# EasyEDA Pro project 工创赛底盘主控v3_2025-03-24.epro, schematic Schematic1
Board Name: Board1; Create Date: 2025-03-23; Page Name: P1; Project Name: 底盘主控v3; Schematic Name: Schematic1; Update Date: 2025-03-24; Company: 嘉立创EDA; Page Size: A4; Version: V1.0
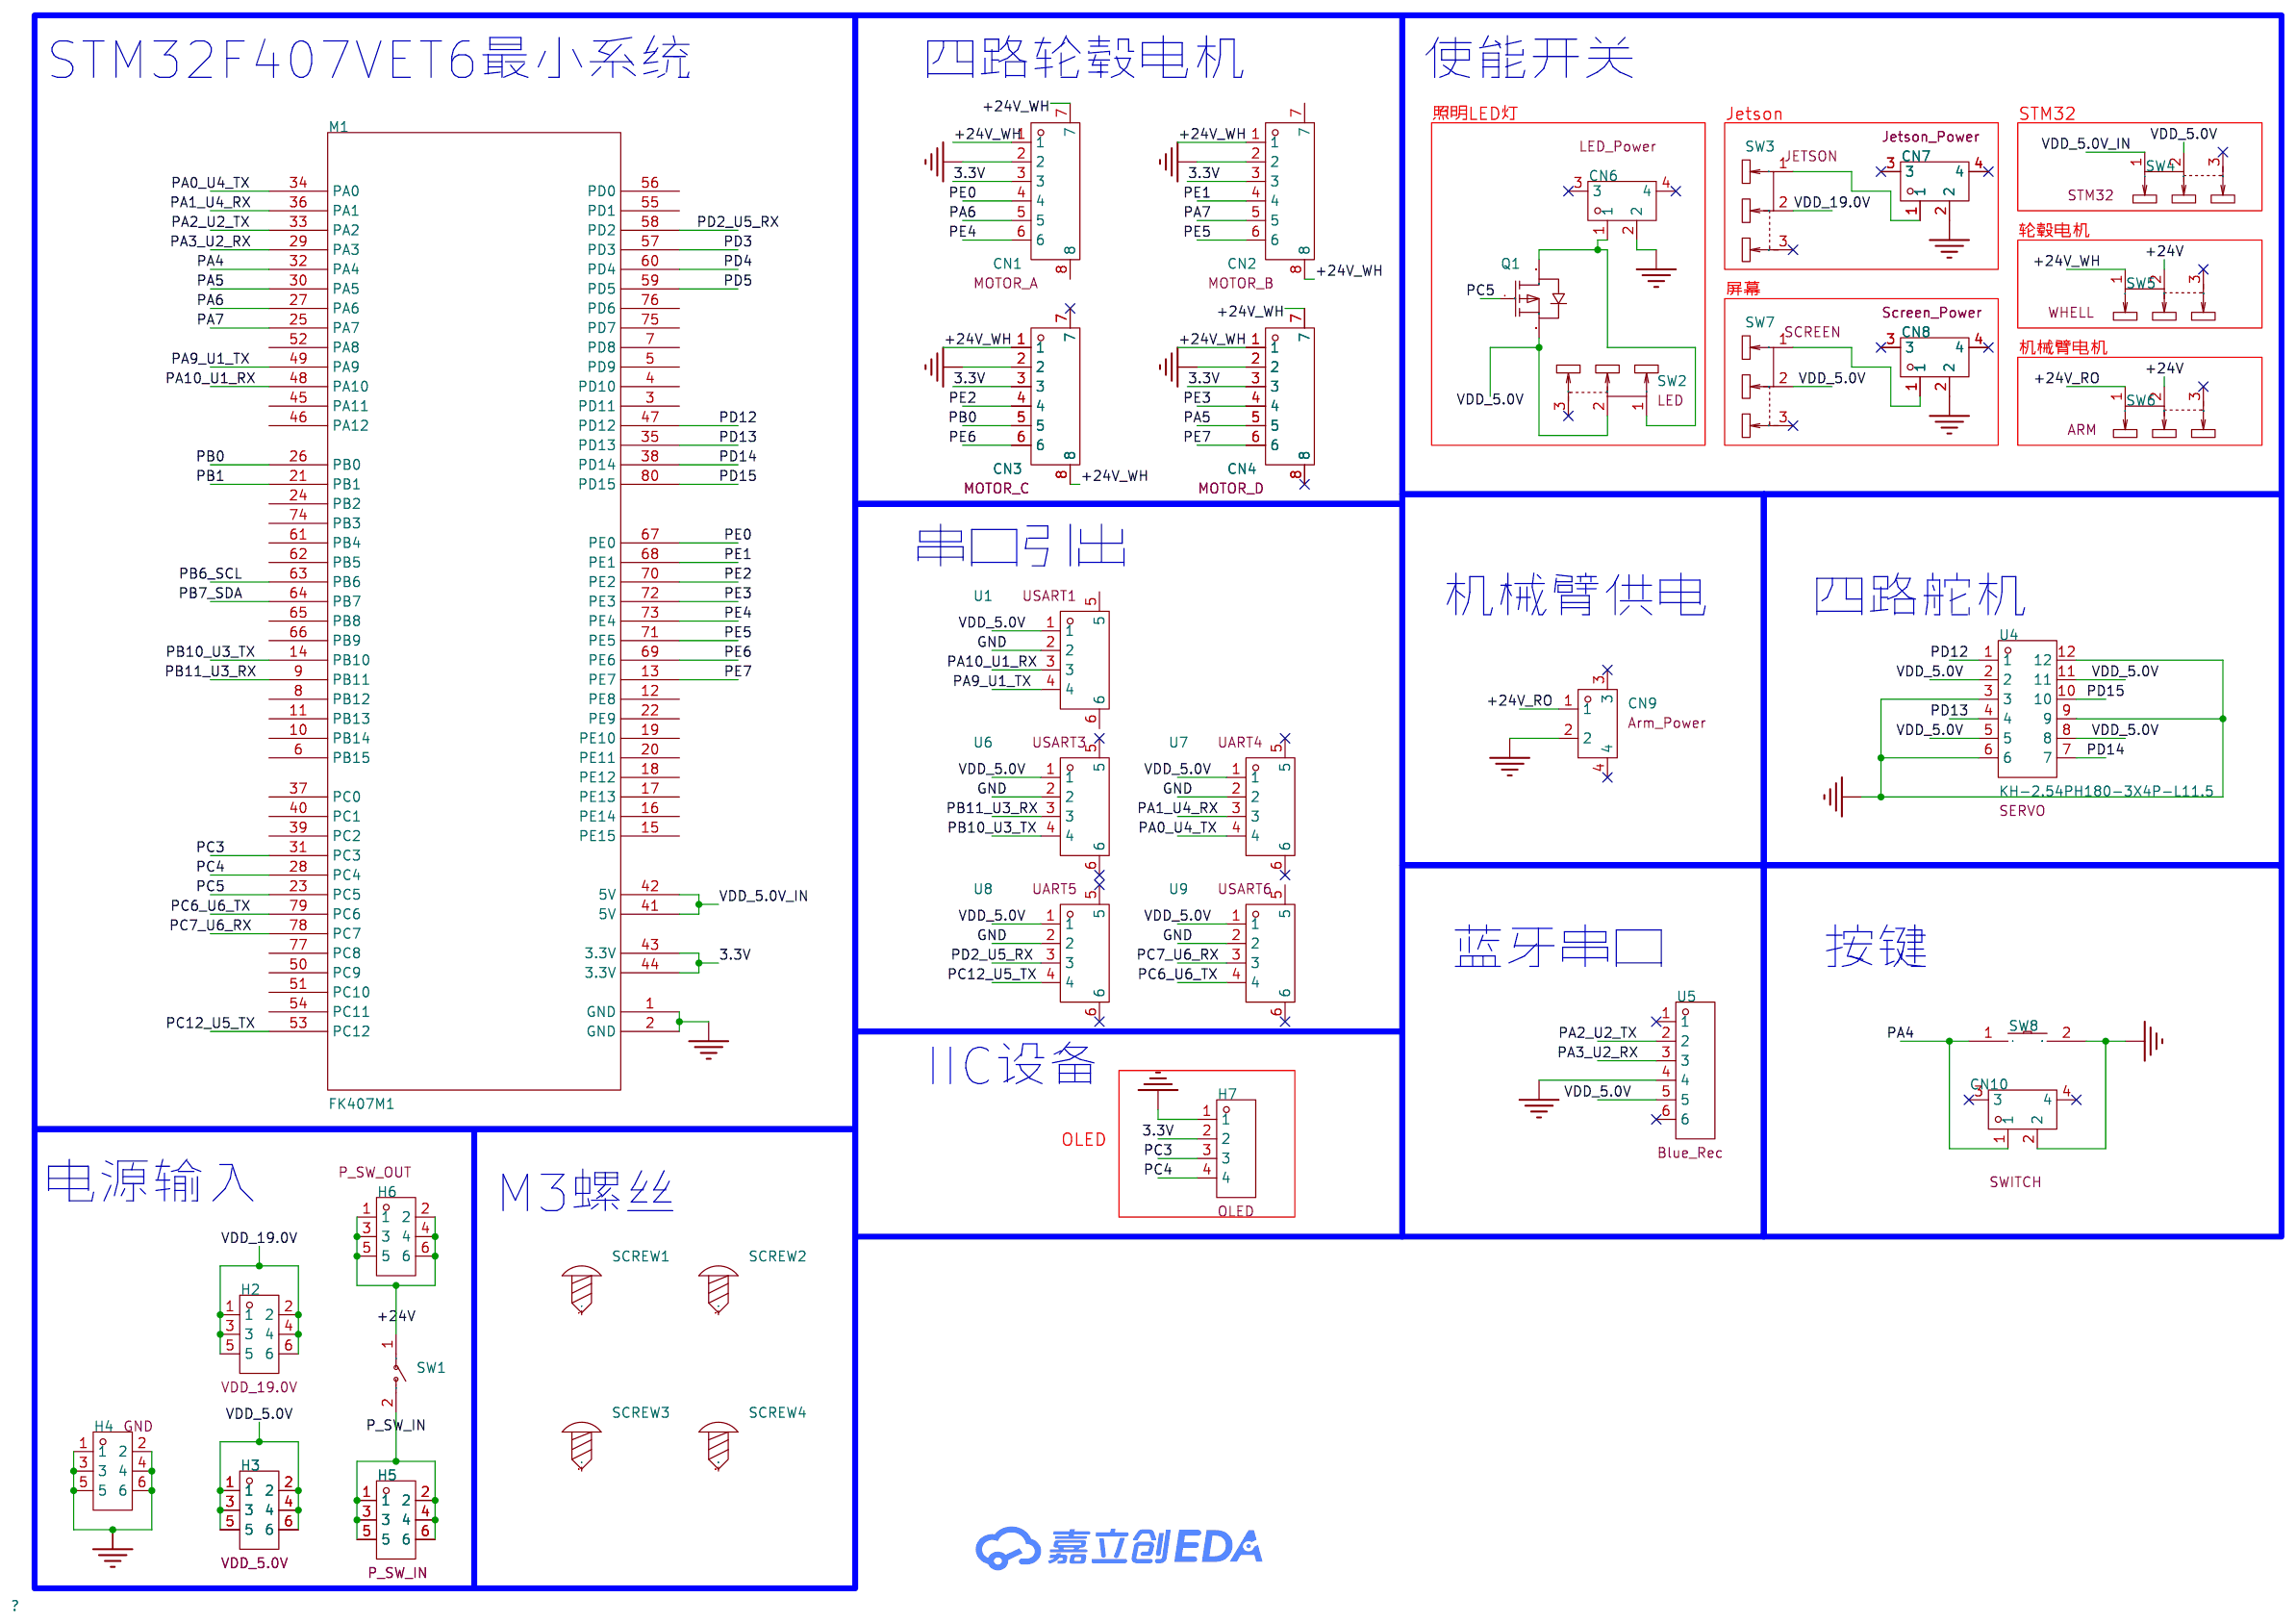
[diagram p2: schematic sheet]

## Parts
CN1  WAFER-254W-6P  [CONN-SMD_WAFER-254W-6P]
CN2  WAFER-254W-6P  [CONN-SMD_WAFER-254W-6P]
CN3  WAFER-254W-6P  [CONN-SMD_WAFER-254W-6P]
CN4  WAFER-254W-6P  [CONN-SMD_WAFER-254W-6P]
CN6  WAFER-254W-2P  [CONN-SMD_2P-L10.0-W7.8-P2.5]
CN7  WAFER-254W-2P  [CONN-SMD_2P-L10.0-W7.8-P2.5]
CN8  WAFER-254W-2P  [CONN-SMD_2P-L10.0-W7.8-P2.5]
CN9  WAFER-254W-2P  [CONN-SMD_2P-L10.0-W7.8-P2.5]
CN10  WAFER-254W-2P  [CONN-SMD_2P-L10.0-W7.8-P2.5]
H2  PZ254-2-03-S  [HDR-SMD_6P-P2.54-V-M-R2-C3-LS7.5-2]
H3  PZ254-2-03-S  [HDR-SMD_6P-P2.54-V-M-R2-C3-LS7.5-2]
H4  PZ254-2-03-S  [HDR-SMD_6P-P2.54-V-M-R2-C3-LS7.5-2]
H5  PZ254-2-03-S  [HDR-SMD_6P-P2.54-V-M-R2-C3-LS7.5-2]
H6  PZ254-2-03-S  [HDR-SMD_6P-P2.54-V-M-R2-C3-LS7.5-2]
H7  2.54-1*4P母  [HDR-TH_4P-P2.54-V-F]
M1  FK407M1  [FK407M1]
Q1  AO3407  [SOT-23-3_L2.9-W1.6-P1.90-LS2.8-BR]
SCREW1  -  [M3螺丝]
SCREW2  -  [M3螺丝]
SCREW3  -  [M3螺丝]
SCREW4  -  [M3螺丝]
SW1  KCD11-2P-R  [SW-TH_2P-L15.0-W10.5-P5.00_KCD11-2P-R]
SW2  SS-12D10L5  [SW-TH_SS-12D10L5]
SW3  SS-12D10L5  [SW-TH_SS-12D10L5]
SW4  SS-12D10L5  [SW-TH_SS-12D10L5]
SW5  SS-12D10L5  [SW-TH_SS-12D10L5]
SW6  SS-12D10L5  [SW-TH_SS-12D10L5]
SW7  SS-12D10L5  [SW-TH_SS-12D10L5]
SW8  TS-1101-C-W  [SW-SMD_L6.0-W3.3-LS8.0]
U1  WAFER-254W-4P  [CONN-SMD_4P-P2.50-WAFER-254W-4P]
U4  KH-2.54PH180-3X4P-L11.5  [HDR-TH-12P-P2.54-V-M-R3-C4-S5.08]
U5  PM2.54-1*6  [HDR-TH_6P-P2.54-V-F]
U6  WAFER-254W-4P  [CONN-SMD_4P-P2.50-WAFER-254W-4P]
U7  WAFER-254W-4P  [CONN-SMD_4P-P2.50-WAFER-254W-4P]
U8  WAFER-254W-4P  [CONN-SMD_4P-P2.50-WAFER-254W-4P]
U9  WAFER-254W-4P  [CONN-SMD_4P-P2.50-WAFER-254W-4P]

## Library data of the parts
CN1 = WAFER-254W-6P: 插针结构:1x6P;间距:2.5mm;安装方式:卧贴;参考系列:-;总PIN数:6P;排数:1;每排PIN数:6;行距:-;额定电流:1A;工作温度范围:-25℃~+85℃;; LCSC Part Name: 1x6P 间距:2.5mm 卧贴; Supplier Part: C2856747; Manufacturer: XUNPU(讯普); Supplier Footprint: SMD,P=2.5mm,卧贴; JLCPCB Part Class: Extended Part; Supplier: LCSC; Pins Structure: 1x6P; Pitch: 2.5mm; Mounting Style: 卧贴; Number of Pins: 6P; Number of Rows: 1; Number of PINs Per Row: 6; Current Rating (Max): 1A; Operating Temperature Range: -25℃~+85℃; Comment: MOTOR_A
CN2 = WAFER-254W-6P: 插针结构:1x6P;间距:2.5mm;安装方式:卧贴;参考系列:-;总PIN数:6P;排数:1;每排PIN数:6;行距:-;额定电流:1A;工作温度范围:-25℃~+85℃;; LCSC Part Name: 1x6P 间距:2.5mm 卧贴; Supplier Part: C2856747; Manufacturer: XUNPU(讯普); Supplier Footprint: SMD,P=2.5mm,卧贴; JLCPCB Part Class: Extended Part; Supplier: LCSC; Pins Structure: 1x6P; Pitch: 2.5mm; Mounting Style: 卧贴; Number of Pins: 6P; Number of Rows: 1; Number of PINs Per Row: 6; Current Rating (Max): 1A; Operating Temperature Range: -25℃~+85℃; Comment: MOTOR_B
CN3 = WAFER-254W-6P: 插针结构:1x6P;间距:2.5mm;安装方式:卧贴;参考系列:-;总PIN数:6P;排数:1;每排PIN数:6;行距:-;额定电流:1A;工作温度范围:-25℃~+85℃;; LCSC Part Name: 1x6P 间距:2.5mm 卧贴; Supplier Part: C2856747; Manufacturer: XUNPU(讯普); Supplier Footprint: SMD,P=2.5mm,卧贴; JLCPCB Part Class: Extended Part; Supplier: LCSC; Pins Structure: 1x6P; Pitch: 2.5mm; Mounting Style: 卧贴; Number of Pins: 6P; Number of Rows: 1; Number of PINs Per Row: 6; Current Rating (Max): 1A; Operating Temperature Range: -25℃~+85℃; Comment: MOTOR_C
CN4 = WAFER-254W-6P: 插针结构:1x6P;间距:2.5mm;安装方式:卧贴;参考系列:-;总PIN数:6P;排数:1;每排PIN数:6;行距:-;额定电流:1A;工作温度范围:-25℃~+85℃;; LCSC Part Name: 1x6P 间距:2.5mm 卧贴; Supplier Part: C2856747; Manufacturer: XUNPU(讯普); Supplier Footprint: SMD,P=2.5mm,卧贴; JLCPCB Part Class: Extended Part; Supplier: LCSC; Pins Structure: 1x6P; Pitch: 2.5mm; Mounting Style: 卧贴; Number of Pins: 6P; Number of Rows: 1; Number of PINs Per Row: 6; Current Rating (Max): 1A; Operating Temperature Range: -25℃~+85℃; Comment: MOTOR_D
CN6 = WAFER-254W-2P: 插针结构:1x2P;间距:2.5mm;安装方式:卧贴;参考系列:-;总PIN数:2P;排数:1;每排PIN数:2;行距:-;额定电流:1A;工作温度范围:-25℃~+85℃;; LCSC Part Name: 1x2P 间距:2.5mm 卧贴; Supplier Part: C2856693; Manufacturer: XUNPU(讯普); Supplier Footprint: SMD,P=2.5mm,卧贴; JLCPCB Part Class: 扩展库; Supplier: LCSC; Pins Structure: 1x2P; Pitch: 2.5mm; Mounting Style: 卧贴; Number of Pins: 2P; Number of Rows: 1; Number of PINs Per Row: 2; Current Rating (Max): 1A; Operating Temperature Range: -25℃~+85℃; Comment: LED_Power
CN7 = WAFER-254W-2P: 插针结构:1x2P;间距:2.5mm;安装方式:卧贴;参考系列:-;总PIN数:2P;排数:1;每排PIN数:2;行距:-;额定电流:1A;工作温度范围:-25℃~+85℃;; LCSC Part Name: 1x2P 间距:2.5mm 卧贴; Supplier Part: C2856693; Manufacturer: XUNPU(讯普); Supplier Footprint: SMD,P=2.5mm,卧贴; JLCPCB Part Class: 扩展库; Supplier: LCSC; Pins Structure: 1x2P; Pitch: 2.5mm; Mounting Style: 卧贴; Number of Pins: 2P; Number of Rows: 1; Number of PINs Per Row: 2; Current Rating (Max): 1A; Operating Temperature Range: -25℃~+85℃; Comment: Jetson_Power
CN8 = WAFER-254W-2P: 插针结构:1x2P;间距:2.5mm;安装方式:卧贴;参考系列:-;总PIN数:2P;排数:1;每排PIN数:2;行距:-;额定电流:1A;工作温度范围:-25℃~+85℃;; LCSC Part Name: 1x2P 间距:2.5mm 卧贴; Supplier Part: C2856693; Manufacturer: XUNPU(讯普); Supplier Footprint: SMD,P=2.5mm,卧贴; JLCPCB Part Class: 扩展库; Supplier: LCSC; Pins Structure: 1x2P; Pitch: 2.5mm; Mounting Style: 卧贴; Number of Pins: 2P; Number of Rows: 1; Number of PINs Per Row: 2; Current Rating (Max): 1A; Operating Temperature Range: -25℃~+85℃; Comment: Screen_Power
CN9 = WAFER-254W-2P: 插针结构:1x2P;间距:2.5mm;安装方式:卧贴;参考系列:-;总PIN数:2P;排数:1;每排PIN数:2;行距:-;额定电流:1A;工作温度范围:-25℃~+85℃;; LCSC Part Name: 1x2P 间距:2.5mm 卧贴; Supplier Part: C2856693; Manufacturer: XUNPU(讯普); Supplier Footprint: SMD,P=2.5mm,卧贴; JLCPCB Part Class: 扩展库; Supplier: LCSC; Pins Structure: 1x2P; Pitch: 2.5mm; Mounting Style: 卧贴; Number of Pins: 2P; Number of Rows: 1; Number of PINs Per Row: 2; Current Rating (Max): 1A; Operating Temperature Range: -25℃~+85℃; Comment: Arm_Power
CN10 = WAFER-254W-2P: 插针结构:1x2P;间距:2.5mm;安装方式:卧贴;参考系列:-;总PIN数:2P;排数:1;每排PIN数:2;行距:-;额定电流:1A;工作温度范围:-25℃~+85℃;; LCSC Part Name: 1x2P 间距:2.5mm 卧贴; Supplier Part: C2856693; Manufacturer: XUNPU(讯普); Supplier Footprint: SMD,P=2.5mm,卧贴; JLCPCB Part Class: 扩展库; Supplier: LCSC; Pins Structure: 1x2P; Pitch: 2.5mm; Mounting Style: 卧贴; Number of Pins: 2P; Number of Rows: 1; Number of PINs Per Row: 2; Current Rating (Max): 1A; Operating Temperature Range: -25℃~+85℃; Comment: SWITCH
H2 = PZ254-2-03-S: 插针结构:2x3P;间距:2.54mm;行距:2.54mm;圆针/方针:方针;安装方式:立贴;排数:双排;总PIN位数:6P;额定电流:3A;额定电压:250V;配合针长度:6mm;塑高:2.5mm;端接针长度:-;工作温度:-40℃~+105℃;颜色:黑色;; LCSC Part Name: 黑色 2x3P 间距:2.54mm 方针 立贴; Supplier Part: C3294461; Manufacturer: HCTL(华灿天禄); Supplier Footprint: SMD,P=2.54mm; JLCPCB Part Class: Extended Part; Datasheet: https://atta.szlcsc.com/upload/public/pdf/source/20230609/FB2B5B924AA338E6CB93C3BD1D012B72.pdf; Supplier: LCSC; Pin Structure: 2x3P; Pitch: 2.54mm; Row Spacing: 2.54mm; Circluar Pins/Square Pins: 方针; Mounting Type: 立贴; Number of Rows: 双排; Number of Pins: 6P; Current Rating: 3A; Voltage Rating (Max): 250V; Length of Mating Pin: 6mm; Insulation Height: 2.5mm; Operating Temperature: -40℃~+105℃; Color: 黑色; Comment: VDD_19.0V
H3 = PZ254-2-03-S: 插针结构:2x3P;间距:2.54mm;行距:2.54mm;圆针/方针:方针;安装方式:立贴;排数:双排;总PIN位数:6P;额定电流:3A;额定电压:250V;配合针长度:6mm;塑高:2.5mm;端接针长度:-;工作温度:-40℃~+105℃;颜色:黑色;; LCSC Part Name: 黑色 2x3P 间距:2.54mm 方针 立贴; Supplier Part: C3294461; Manufacturer: HCTL(华灿天禄); Supplier Footprint: SMD,P=2.54mm; JLCPCB Part Class: Extended Part; Datasheet: https://atta.szlcsc.com/upload/public/pdf/source/20230609/FB2B5B924AA338E6CB93C3BD1D012B72.pdf; Supplier: LCSC; Pin Structure: 2x3P; Pitch: 2.54mm; Row Spacing: 2.54mm; Circluar Pins/Square Pins: 方针; Mounting Type: 立贴; Number of Rows: 双排; Number of Pins: 6P; Current Rating: 3A; Voltage Rating (Max): 250V; Length of Mating Pin: 6mm; Insulation Height: 2.5mm; Operating Temperature: -40℃~+105℃; Color: 黑色; Comment: VDD_5.0V
H4 = PZ254-2-03-S: 插针结构:2x3P;间距:2.54mm;行距:2.54mm;圆针/方针:方针;安装方式:立贴;排数:双排;总PIN位数:6P;额定电流:3A;额定电压:250V;配合针长度:6mm;塑高:2.5mm;端接针长度:-;工作温度:-40℃~+105℃;颜色:黑色;; LCSC Part Name: 黑色 2x3P 间距:2.54mm 方针 立贴; Supplier Part: C3294461; Manufacturer: HCTL(华灿天禄); Supplier Footprint: SMD,P=2.54mm; JLCPCB Part Class: Extended Part; Datasheet: https://atta.szlcsc.com/upload/public/pdf/source/20230609/FB2B5B924AA338E6CB93C3BD1D012B72.pdf; Supplier: LCSC; Pin Structure: 2x3P; Pitch: 2.54mm; Row Spacing: 2.54mm; Circluar Pins/Square Pins: 方针; Mounting Type: 立贴; Number of Rows: 双排; Number of Pins: 6P; Current Rating: 3A; Voltage Rating (Max): 250V; Length of Mating Pin: 6mm; Insulation Height: 2.5mm; Operating Temperature: -40℃~+105℃; Color: 黑色; Comment: GND
H5 = PZ254-2-03-S: 插针结构:2x3P;间距:2.54mm;行距:2.54mm;圆针/方针:方针;安装方式:立贴;排数:双排;总PIN位数:6P;额定电流:3A;额定电压:250V;配合针长度:6mm;塑高:2.5mm;端接针长度:-;工作温度:-40℃~+105℃;颜色:黑色;; LCSC Part Name: 黑色 2x3P 间距:2.54mm 方针 立贴; Supplier Part: C3294461; Manufacturer: HCTL(华灿天禄); Supplier Footprint: SMD,P=2.54mm; JLCPCB Part Class: Extended Part; Datasheet: https://atta.szlcsc.com/upload/public/pdf/source/20230609/FB2B5B924AA338E6CB93C3BD1D012B72.pdf; Supplier: LCSC; Pin Structure: 2x3P; Pitch: 2.54mm; Row Spacing: 2.54mm; Circluar Pins/Square Pins: 方针; Mounting Type: 立贴; Number of Rows: 双排; Number of Pins: 6P; Current Rating: 3A; Voltage Rating (Max): 250V; Length of Mating Pin: 6mm; Insulation Height: 2.5mm; Operating Temperature: -40℃~+105℃; Color: 黑色; Comment: P_SW_IN
H6 = PZ254-2-03-S: 插针结构:2x3P;间距:2.54mm;行距:2.54mm;圆针/方针:方针;安装方式:立贴;排数:双排;总PIN位数:6P;额定电流:3A;额定电压:250V;配合针长度:6mm;塑高:2.5mm;端接针长度:-;工作温度:-40℃~+105℃;颜色:黑色;; LCSC Part Name: 黑色 2x3P 间距:2.54mm 方针 立贴; Supplier Part: C3294461; Manufacturer: HCTL(华灿天禄); Supplier Footprint: SMD,P=2.54mm; JLCPCB Part Class: Extended Part; Datasheet: https://atta.szlcsc.com/upload/public/pdf/source/20230609/FB2B5B924AA338E6CB93C3BD1D012B72.pdf; Supplier: LCSC; Pin Structure: 2x3P; Pitch: 2.54mm; Row Spacing: 2.54mm; Circluar Pins/Square Pins: 方针; Mounting Type: 立贴; Number of Rows: 双排; Number of Pins: 6P; Current Rating: 3A; Voltage Rating (Max): 250V; Length of Mating Pin: 6mm; Insulation Height: 2.5mm; Operating Temperature: -40℃~+105℃; Color: 黑色; Comment: P_SW_OUT
H7 = 2.54-1*4P母: 插孔结构:1x4P;间距:2.54mm;行距:-;圆孔/方孔:方孔;安装类型:直插;排数:单排;总孔位数:4P;额定电流:3A;额定电压:-;插孔方向:顶部;塑高:-;触头材质:青铜;触头镀层:-;工作温度范围:-40℃~+105℃;焊接温度(最大值):-;; LCSC Part Name: 间距:2.54mm 1x4P 直插; Supplier Part: C2718488; Manufacturer: BOOMELE(博穆精密); Supplier Footprint: 插件,P=2.54mm; JLCPCB Part Class: Extended Part; Datasheet: https://atta.szlcsc.com/upload/public/pdf/source/20210301/C2718488_F4427B881E42CAA8DDB0B1C12B3A522C.pdf; Supplier: LCSC; Holes Structure: 1x4P; Pitch: 2.54mm; Circular Hole / Square Hole: 方孔; Mounting Type: 直插; Number of Rows: 单排; Number of Holes: 4P; Current Rating (Max): 3A; Holes Direction: 顶部; Contact Material: 青铜; Operating Temperature Range: -40℃~+105℃; Comment: OLED
M1 = FK407M1
Q1 = AO3407: 类型:1个P沟道;漏源电压(Vdss):30V;连续漏极电流(Id):4.1A;导通电阻(RDS(on)@Vgs,Id):87mΩ@4.5V,3A;功率:350mW;阈值电压(Vgs(th)@Id):3V@250uA;; LCSC Part Name: 1个P沟道 耐压:30V 电流:4.1A; Supplier Part: C727158; Manufacturer: TWGMC(台湾迪嘉); Supplier Footprint: SOT-23; JLCPCB Part Class: Extended Part; Datasheet: https://atta.szlcsc.com/upload/public/pdf/source/20200827/C727158_282ADD6E8EE14B419EAB19F2812EAF45.pdf; Supplier: LCSC; Type: 1个P沟道; Drain Source Voltage (Vdss): 30V; Continuous Drain Current (Id): 4.1A; Drain Source On Resistance (RDS(on)@Vgs,Id): 87mΩ@4.5V,3A; Power Dissipation (Pd): 350mW; Gate Threshold Voltage (Vgs(th)@Id): 3V@250uA; Input Capacitance (Ciss@Vds): 700pF; Reverse Transfer Capacitance (Crss@Vds): 75pF; Operating Temperature: -40℃~+150℃
SCREW1-SCREW4 = M3螺丝: Supplier Footprint: 插件
SW1 = KCD11-2P-R: 带灯:无;引脚样式:焊片;额定电流:3A;额定电压(AC):250V;额定电压(DC):-;电路结构:单刀单掷;机械寿命:1万次;; LCSC Part Name: 10.5*15mm 两脚两档跷板开关 红钮; Supplier Part: C5884414; Manufacturer: SHOU HAN(首韩); Supplier Footprint: 插件; JLCPCB Part Class: 扩展库; Datasheet: https://atta.szlcsc.com/upload/public/pdf/source/20230506/CD06DFDE35C8048D34175BFF4AF6A2C2.pdf; Supplier: LCSC; Switch Length: 15mm; Switch Width: 10.5mm; Switch Height: 17.2mm; Actuator Type: 凹面弯曲; With Lamp: 无; Pin Style: 焊片; Actuator Color: 红色; Contact Current: 3A; Voltage Rating (AC): 250V; Circuit: 单刀单掷; Mechanical Life: 1万次; Operating Temperature: 0℃~+125℃; Actuator Identifier: - O
SW2 = SS-12D10L5: 电路结构:单刀双掷;安装方式:直插;开关颜色:黑色;额定电流(DC):3A;额定电压(DC):125V;额定电流(AC):3A;额定电压(AC):125V;机械寿命:1万次;; LCSC Part Name: 柄长5mm 直插双档 滑动开关; Supplier Part: C319012; Manufacturer: XKB Connectivity(中国星坤); Supplier Footprint: 插件; JLCPCB Part Class: 扩展库; Datasheet: https://atta.szlcsc.com/upload/public/pdf/source/20211009/D6412F37AABE6F9459A6EE7FA4DAEADB.pdf; Supplier: LCSC; Circuit: 单刀双掷; Actuator Style: 矩形柱状; Pin Style: PC引脚; Switch Length: 13mm; Switch Width: 6.8mm; Switch Height: 6.4mm; Mounting Style: 直插; Actuator Color: 黑色; Current Rating (DC): 3A; Voltage Rating (DC): 125V; Current Rating (AC): 3A; Voltage Rating (AC): 125V; Mechanical Life: 1万次; Operating Temperature: -40℃~+85℃; Comment: LED
SW3 = SS-12D10L5: 电路结构:单刀双掷;安装方式:直插;开关颜色:黑色;额定电流(DC):3A;额定电压(DC):125V;额定电流(AC):3A;额定电压(AC):125V;机械寿命:1万次;; LCSC Part Name: 柄长5mm 直插双档 滑动开关; Supplier Part: C319012; Manufacturer: XKB Connectivity(中国星坤); Supplier Footprint: 插件; JLCPCB Part Class: 扩展库; Datasheet: https://atta.szlcsc.com/upload/public/pdf/source/20211009/D6412F37AABE6F9459A6EE7FA4DAEADB.pdf; Supplier: LCSC; Circuit: 单刀双掷; Actuator Style: 矩形柱状; Pin Style: PC引脚; Switch Length: 13mm; Switch Width: 6.8mm; Switch Height: 6.4mm; Mounting Style: 直插; Actuator Color: 黑色; Current Rating (DC): 3A; Voltage Rating (DC): 125V; Current Rating (AC): 3A; Voltage Rating (AC): 125V; Mechanical Life: 1万次; Operating Temperature: -40℃~+85℃; Comment: JETSON
SW4 = SS-12D10L5: 电路结构:单刀双掷;安装方式:直插;开关颜色:黑色;额定电流(DC):3A;额定电压(DC):125V;额定电流(AC):3A;额定电压(AC):125V;机械寿命:1万次;; LCSC Part Name: 柄长5mm 直插双档 滑动开关; Supplier Part: C319012; Manufacturer: XKB Connectivity(中国星坤); Supplier Footprint: 插件; JLCPCB Part Class: 扩展库; Datasheet: https://atta.szlcsc.com/upload/public/pdf/source/20211009/D6412F37AABE6F9459A6EE7FA4DAEADB.pdf; Supplier: LCSC; Circuit: 单刀双掷; Actuator Style: 矩形柱状; Pin Style: PC引脚; Switch Length: 13mm; Switch Width: 6.8mm; Switch Height: 6.4mm; Mounting Style: 直插; Actuator Color: 黑色; Current Rating (DC): 3A; Voltage Rating (DC): 125V; Current Rating (AC): 3A; Voltage Rating (AC): 125V; Mechanical Life: 1万次; Operating Temperature: -40℃~+85℃; Comment: STM32
SW5 = SS-12D10L5: 电路结构:单刀双掷;安装方式:直插;开关颜色:黑色;额定电流(DC):3A;额定电压(DC):125V;额定电流(AC):3A;额定电压(AC):125V;机械寿命:1万次;; LCSC Part Name: 柄长5mm 直插双档 滑动开关; Supplier Part: C319012; Manufacturer: XKB Connectivity(中国星坤); Supplier Footprint: 插件; JLCPCB Part Class: 扩展库; Datasheet: https://atta.szlcsc.com/upload/public/pdf/source/20211009/D6412F37AABE6F9459A6EE7FA4DAEADB.pdf; Supplier: LCSC; Circuit: 单刀双掷; Actuator Style: 矩形柱状; Pin Style: PC引脚; Switch Length: 13mm; Switch Width: 6.8mm; Switch Height: 6.4mm; Mounting Style: 直插; Actuator Color: 黑色; Current Rating (DC): 3A; Voltage Rating (DC): 125V; Current Rating (AC): 3A; Voltage Rating (AC): 125V; Mechanical Life: 1万次; Operating Temperature: -40℃~+85℃; Comment: WHELL
SW6 = SS-12D10L5: 电路结构:单刀双掷;安装方式:直插;开关颜色:黑色;额定电流(DC):3A;额定电压(DC):125V;额定电流(AC):3A;额定电压(AC):125V;机械寿命:1万次;; LCSC Part Name: 柄长5mm 直插双档 滑动开关; Supplier Part: C319012; Manufacturer: XKB Connectivity(中国星坤); Supplier Footprint: 插件; JLCPCB Part Class: 扩展库; Datasheet: https://atta.szlcsc.com/upload/public/pdf/source/20211009/D6412F37AABE6F9459A6EE7FA4DAEADB.pdf; Supplier: LCSC; Circuit: 单刀双掷; Actuator Style: 矩形柱状; Pin Style: PC引脚; Switch Length: 13mm; Switch Width: 6.8mm; Switch Height: 6.4mm; Mounting Style: 直插; Actuator Color: 黑色; Current Rating (DC): 3A; Voltage Rating (DC): 125V; Current Rating (AC): 3A; Voltage Rating (AC): 125V; Mechanical Life: 1万次; Operating Temperature: -40℃~+85℃; Comment: ARM
SW7 = SS-12D10L5: 电路结构:单刀双掷;安装方式:直插;开关颜色:黑色;额定电流(DC):3A;额定电压(DC):125V;额定电流(AC):3A;额定电压(AC):125V;机械寿命:1万次;; LCSC Part Name: 柄长5mm 直插双档 滑动开关; Supplier Part: C319012; Manufacturer: XKB Connectivity(中国星坤); Supplier Footprint: 插件; JLCPCB Part Class: 扩展库; Datasheet: https://atta.szlcsc.com/upload/public/pdf/source/20211009/D6412F37AABE6F9459A6EE7FA4DAEADB.pdf; Supplier: LCSC; Circuit: 单刀双掷; Actuator Style: 矩形柱状; Pin Style: PC引脚; Switch Length: 13mm; Switch Width: 6.8mm; Switch Height: 6.4mm; Mounting Style: 直插; Actuator Color: 黑色; Current Rating (DC): 3A; Voltage Rating (DC): 125V; Current Rating (AC): 3A; Voltage Rating (AC): 125V; Mechanical Life: 1万次; Operating Temperature: -40℃~+85℃; Comment: SCREEN
SW8 = TS-1101-C-W: 电路结构:单刀单掷;按钮形状:矩形按钮;作用力:260gf;安装方式:立贴;开关长度:6mm;开关宽度:3.6mm;开关高度:2.5mm;带支架:不带;触点电流:50mA;额定电压(AC):-;额定电压(DC):12V;额定功率:-;绝缘电阻:-;带灯:无;机械寿命:5万次;; LCSC Part Name: 6*3.6*2.5mm 立贴 轻触开关; Supplier Part: C318938; Manufacturer: XKB Connectivity(中国星坤); Supplier Footprint: SMD; JLCPCB Part Class: Extended Part; Datasheet: https://atta.szlcsc.com/upload/public/pdf/source/20200227/C318938_C2E53B1EEDE37D980A33616AC086DE53.pdf; Supplier: LCSC; Circuit: 单刀单掷; Actuator Style: 矩形按钮; Operating Force: 260gf; Mounting Style: 立贴; Switch Length: 6mm; Switch Width: 3.6mm; Switch Height: 2.5mm; Strike Gundam: 不带; Contact Current: 50mA; Voltage Rating (DC): 12V; Actuator/Cap Color: 白色带淡绿; With Lamp: 无; Mechanical Life: 5万次; Operating Temperature: -30℃~+85℃
U1 = WAFER-254W-4P: 插针结构:1x4P;间距:2.5mm;安装方式:卧贴;参考系列:-;总PIN数:4P;排数:1;每排PIN数:4;行距:-;额定电流:1A;工作温度范围:-25℃~+85℃;; LCSC Part Name: 1x4P 间距:2.5mm 卧贴; Supplier Part: C2856745; Manufacturer: XUNPU(讯普); Supplier Footprint: SMD,P=2.5mm,卧贴; JLCPCB Part Class: 扩展库; Supplier: LCSC; Pins Structure: 1x4P; Pitch: 2.5mm; Mounting Style: 卧贴; Number of Pins: 4P; Number of Rows: 1; Number of PINs Per Row: 4; Current Rating (Max): 1A; Operating Temperature Range: -25℃~+85℃; Comment: USART1
U4 = KH-2.54PH180-3X4P-L11.5: 插针结构:3x4P;间距:2.54mm;排数:三排;; LCSC Part Name: 3x4P 间距:2.54mm; Supplier Part: C20610251; Manufacturer: kinghelm(金航标); Supplier Footprint: 插件,P=2.54mm; JLCPCB Part Class: Extended Part; Datasheet: https://atta.szlcsc.com/upload/public/pdf/source/20240117/4BA680E74C5133517A115D97C2D310BD.pdf; Supplier: LCSC; Pin Structure: 3x4P; Pitch: 2.54mm; Number of Rows: 三排; Comment: SERVO
U5 = PM2.54-1*6: 插孔结构:1x6P;间距:2.54mm;行距:2.54mm;圆孔/方孔:方孔;安装类型:直插;排数:单排;总孔位数:6P;额定电流:2.5A;插孔方向:顶部;塑高:8.5mm;工作温度范围:-40℃~+105℃;; LCSC Part Name: 间距:2.54mm 1x6P 直插; Supplier Part: C5224026; Manufacturer: ZHOURI(洲日); Supplier Footprint: 插件,P=2.54mm; JLCPCB Part Class: 扩展库; Datasheet: https://atta.szlcsc.com/upload/public/pdf/source/20221031/E093F9F6C4E58F4CC51055FE981DF342.pdf; Supplier: LCSC; Holes Structure: 1x6P; Pitch: 2.54mm; Row Spacing: 2.54mm; Circular Hole / Square Hole: 方孔; Mounting Type: 直插; Number of Rows: 单排; Number of Holes: 6P; Current Rating (Max): 2.5A; Holes Direction: 顶部; Insulation Height: 8.5mm; Operating Temperature Range: -40℃~+105℃; Comment: Blue_Rec
U6 = WAFER-254W-4P: 插针结构:1x4P;间距:2.5mm;安装方式:卧贴;参考系列:-;总PIN数:4P;排数:1;每排PIN数:4;行距:-;额定电流:1A;工作温度范围:-25℃~+85℃;; LCSC Part Name: 1x4P 间距:2.5mm 卧贴; Supplier Part: C2856745; Manufacturer: XUNPU(讯普); Supplier Footprint: SMD,P=2.5mm,卧贴; JLCPCB Part Class: 扩展库; Supplier: LCSC; Pins Structure: 1x4P; Pitch: 2.5mm; Mounting Style: 卧贴; Number of Pins: 4P; Number of Rows: 1; Number of PINs Per Row: 4; Current Rating (Max): 1A; Operating Temperature Range: -25℃~+85℃; Comment: USART3
U7 = WAFER-254W-4P: 插针结构:1x4P;间距:2.5mm;安装方式:卧贴;参考系列:-;总PIN数:4P;排数:1;每排PIN数:4;行距:-;额定电流:1A;工作温度范围:-25℃~+85℃;; LCSC Part Name: 1x4P 间距:2.5mm 卧贴; Supplier Part: C2856745; Manufacturer: XUNPU(讯普); Supplier Footprint: SMD,P=2.5mm,卧贴; JLCPCB Part Class: 扩展库; Supplier: LCSC; Pins Structure: 1x4P; Pitch: 2.5mm; Mounting Style: 卧贴; Number of Pins: 4P; Number of Rows: 1; Number of PINs Per Row: 4; Current Rating (Max): 1A; Operating Temperature Range: -25℃~+85℃; Comment: UART4
U8 = WAFER-254W-4P: 插针结构:1x4P;间距:2.5mm;安装方式:卧贴;参考系列:-;总PIN数:4P;排数:1;每排PIN数:4;行距:-;额定电流:1A;工作温度范围:-25℃~+85℃;; LCSC Part Name: 1x4P 间距:2.5mm 卧贴; Supplier Part: C2856745; Manufacturer: XUNPU(讯普); Supplier Footprint: SMD,P=2.5mm,卧贴; JLCPCB Part Class: 扩展库; Supplier: LCSC; Pins Structure: 1x4P; Pitch: 2.5mm; Mounting Style: 卧贴; Number of Pins: 4P; Number of Rows: 1; Number of PINs Per Row: 4; Current Rating (Max): 1A; Operating Temperature Range: -25℃~+85℃; Comment: UART5
U9 = WAFER-254W-4P: 插针结构:1x4P;间距:2.5mm;安装方式:卧贴;参考系列:-;总PIN数:4P;排数:1;每排PIN数:4;行距:-;额定电流:1A;工作温度范围:-25℃~+85℃;; LCSC Part Name: 1x4P 间距:2.5mm 卧贴; Supplier Part: C2856745; Manufacturer: XUNPU(讯普); Supplier Footprint: SMD,P=2.5mm,卧贴; JLCPCB Part Class: 扩展库; Supplier: LCSC; Pins Structure: 1x4P; Pitch: 2.5mm; Mounting Style: 卧贴; Number of Pins: 4P; Number of Rows: 1; Number of PINs Per Row: 4; Current Rating (Max): 1A; Operating Temperature Range: -25℃~+85℃; Comment: USART6

## Nets
3.3V: CN1.3 CN2.3 CN3.3 CN4.3 H7.2 M1.43(3.3V) M1.44(3.3V)
+24V: H6.1 H6.2 H6.3 H6.4 H6.5 H6.6 SW1.1 SW5.2 SW6.2
+24V_RO: CN9.1 SW6.1
+24V_WH: CN1.1 CN1.7 CN2.1 CN2.8 CN3.1 CN3.8 CN4.1 CN4.7 SW5.1
GND: CN1.2 CN2.2 CN3.2 CN4.2 CN6.2 CN7.2 CN8.2 CN9.2 CN10.2 H4.1 H4.2 H4.3 H4.4 H4.5 H4.6 H7.1 M1.1(GND) M1.2(GND) SW8.2 U1.2 U4.3 U4.6 U4.9 U4.12 U5.4 U6.2 U7.2 U8.2 U9.2
VDD_5.0V: H3.1 H3.2 H3.3 H3.4 H3.5 H3.6 Q1.2(S) SW2.2 SW4.2 SW7.2 U1.1 U4.2 U4.5 U4.8 U4.11 U5.5 U6.1 U7.1 U8.1 U9.1
VDD_5.0V_IN: M1.41(5V) M1.42(5V) SW4.1
VDD_19.0V: H2.1 H2.2 H2.3 H2.4 H2.5 H2.6 SW3.2
P_SW_IN: H5.1 H5.2 H5.3 H5.4 H5.5 H5.6 SW1.2
PA0_U4_TX: M1.34(PA0) U7.4
PA1_U4_RX: M1.36(PA1) U7.3
PA2_U2_TX: M1.33(PA2) U5.2
PA3_U2_RX: M1.29(PA3) U5.3
PA4: CN10.1 M1.32(PA4) SW8.1
PA5: CN4.5 M1.30(PA5)
PA6: CN1.5 M1.27(PA6)
PA7: CN2.5 M1.25(PA7)
PA9_U1_TX: M1.49(PA9) U1.4
PA10_U1_RX: M1.48(PA10) U1.3
PB0: CN3.5 M1.26(PB0)
PB1: M1.21(PB1)
PB6_SCL: M1.63(PB6)
PB7_SDA: M1.64(PB7)
PB10_U3_TX: M1.14(PB10) U6.4
PB11_U3_RX: M1.9(PB11) U6.3
PC3: H7.3 M1.31(PC3)
PC4: H7.4 M1.28(PC4)
PC5: M1.23(PC5) Q1.1(G)
PC6_U6_TX: M1.79(PC6) U9.4
PC7_U6_RX: M1.78(PC7) U9.3
PC12_U5_TX: M1.53(PC12) U8.4
PD2_U5_RX: M1.58(PD2) U8.3
PD3: M1.57(PD3)
PD4: M1.60(PD4)
PD5: M1.59(PD5)
PD12: M1.47(PD12) U4.1
PD13: M1.35(PD13) U4.4
PD14: M1.38(PD14) U4.7
PD15: M1.80(PD15) U4.10
PE0: CN1.4 M1.67(PE0)
PE1: CN2.4 M1.68(PE1)
PE2: CN3.4 M1.70(PE2)
PE3: CN4.4 M1.72(PE3)
PE4: CN1.6 M1.73(PE4)
PE5: CN2.6 M1.71(PE5)
PE6: CN3.6 M1.69(PE6)
PE7: CN4.6 M1.13(PE7)
$1N1643: CN6.1 Q1.3(D) SW2.1
$1N3078: CN7.1 SW3.1
$1N3176: CN8.1 SW7.1

Not connected (* = marked no-connect by the designer): CN1 8; CN2 7; CN3 7*; CN4 8*; CN6 3* 4*; CN7 3* 4*; CN8 3* 4*; CN9 3* 4*; CN10 3* 4*; M1 3(PD11) 4(PD10) 5(PD9) 6(PB15) 7(PD8) 8(PB12) 10(PB14) 11(PB13) 12(PE8) 15(PE15) 16(PE14) 17(PE13) 18(PE12) 19(PE10) 20(PE11) 22(PE9) 24(PB2) 37(PC0) 39(PC2) 40(PC1) 45(PA11) 46(PA12) 50(PC9) 51(PC10) 52(PA8) 54(PC11) 55(PD1) 56(PD0) 61(PB4) 62(PB5) 65(PB8) 66(PB9) 74(PB3) 75(PD7) 76(PD6) 77(PC8); SCREW1 1; SCREW2 1; SCREW3 1; SCREW4 1; SW2 3*; SW3 3*; SW4 3*; SW5 3*; SW6 3*; SW7 3*; U1 5 6; U5 1* 6*; U6 5* 6*; U7 5* 6*; U8 5* 6*; U9 5 6*

## Notes on the sheet
- STM32F407VET6最小系统
- 四路轮毂电机
- 使能开关
- 照明LED灯
- Jetson
- STM32
- 轮毂电机
- 屏幕
- 机械臂电机
- 串口引出
- 机械臂供电
- 四路舵机
- 蓝牙串口
- 按键
- IIC设备
- OLED
- 电源输入
- M3螺丝
